# Altium schematic sheet FPGA_board_and_power.SchDoc
size A4
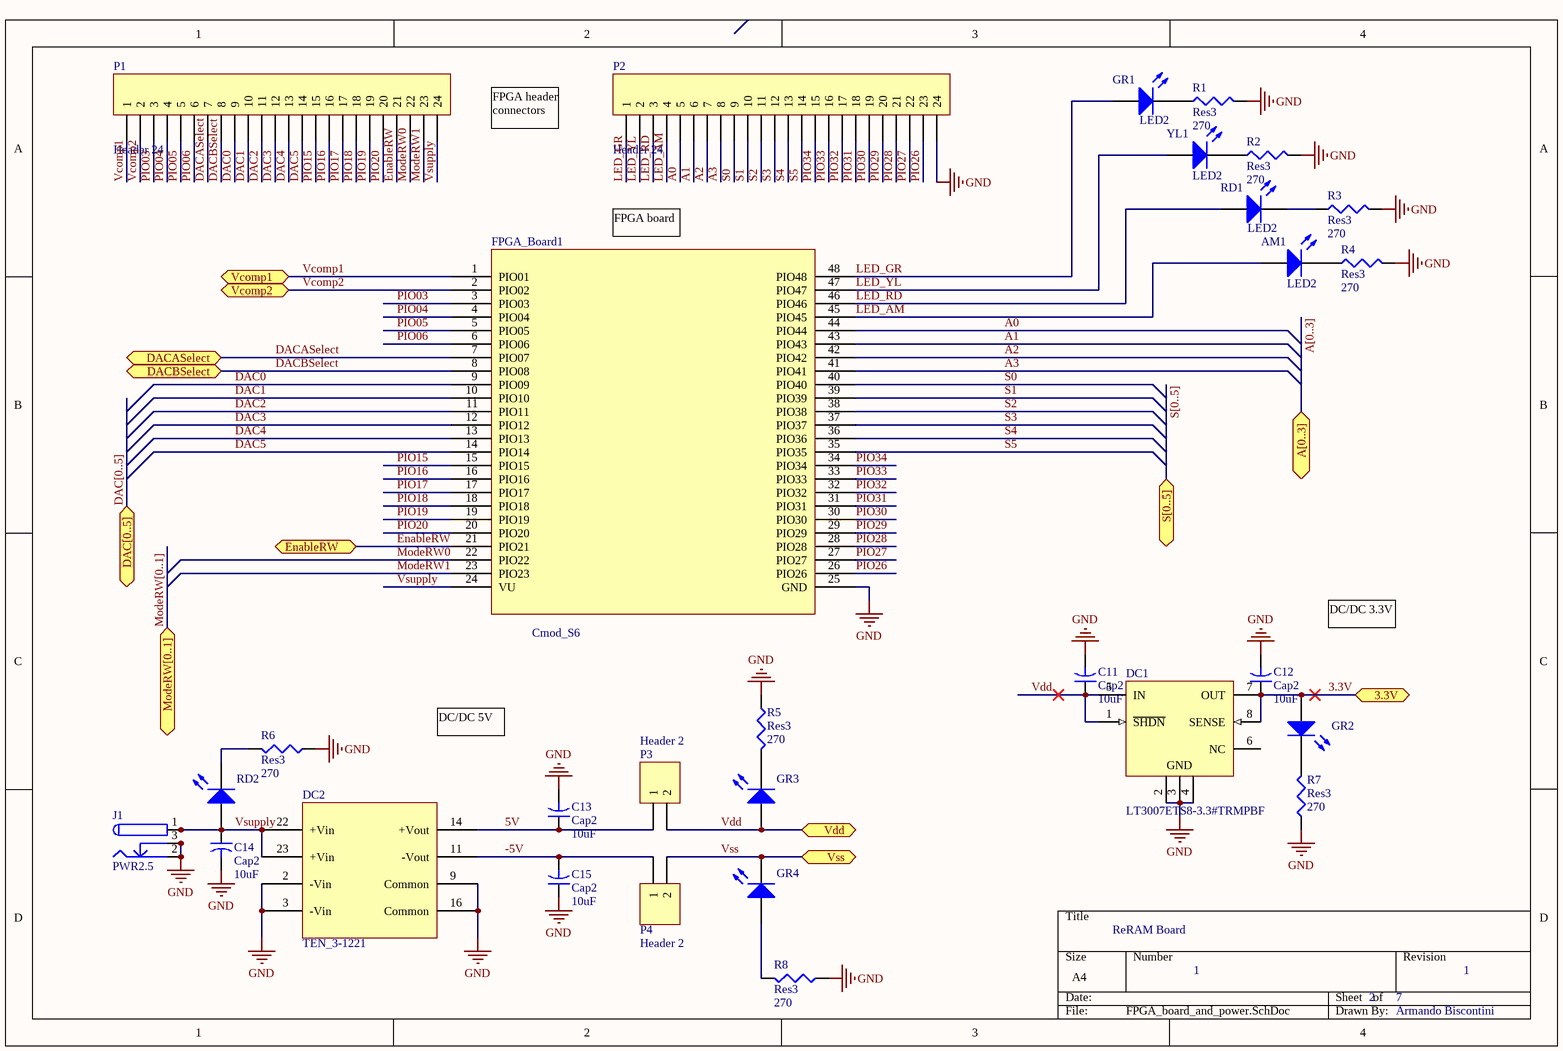
[diagram p0: FPGA_board_and_power.SchDoc]

## Parts
AM1  LED2  [3.2X1.6X1.1]
C11  Cap2  value 10uF  [CAPR5-4X5]
C12  Cap2  value 10uF  [CAPR5-4X5]
C13  Cap2  value 10uF  [CAPR5-4X5]
C14  Cap2  value 10uF  [CAPR5-4X5]
C15  Cap2  value 10uF  [CAPR5-4X5]
DC1  LT3007ETS8-3.3#TRMPBF  [LT-TS8-8-TSOT-23_V]
DC2  TEN_3-1221  [TEN_3-1221]
FPGA_Board1  Cmod_S6  [Cmod_S6_double_conn]
GR1  LED2  [3.2X1.6X1.1]
GR2  (no value)  [3.2X1.6X1.1]
GR3  (no value)  [3.2X1.6X1.1]
GR4  (no value)  [3.2X1.6X1.1]
J1  PWR2.5  [KLD-0202]
P1  Header 24  [HDR1X24]
P2  Header 24  [HDR1X24]
P3  Header 2  [HDR1X2]
P4  Header 2  [HDR1X2]
R1  Res3  value 270  [J1-0603]
R2  Res3  value 270  [J1-0603]
R3  Res3  value 270  [J1-0603]
R4  Res3  value 270  [J1-0603]
R5  Res3  value 270  [J1-0603]
R6  Res3  value 270  [J1-0603]
R7  Res3  value 270  [J1-0603]
R8  Res3  value 270  [J1-0603]
RD1  LED2  [3.2X1.6X1.1]
RD2  (no value)  [3.2X1.6X1.1]
YL1  LED2  [3.2X1.6X1.1]

## Ports
3.3V, A[0..3], DAC[0..5], DACASelect, DACBSelect, EnableRW, ModeRW[0..1], S[0..5], Vcomp1, Vcomp2, Vdd, Vss

## Nets
GND: C11.2 C12.2 C13.2 C14.2 C15.1 DC1.2(GND) DC1.3(GND) DC1.4(GND) DC2.2(-Vin) DC2.3(-Vin) DC2.9(Common) DC2.16(Common) FPGA_Board1.25(GND) J1.2 J1.2A J1.2B J1.3 J1.3A J1.3B P2.24 R1.1 R2.1 R3.1 R4.1 R5.2 R6.2 R7.2 R8.2
3.3V: C12.1 DC1.7(OUT) DC1.8(SENSE) GR2.1(A) ; port 3.3V
5V: C13.1 DC2.14(+Vout) P3.1
-5V: C15.2 DC2.11(-Vout) P4.1
A0: FPGA_Board1.44(PIO44) P2.5
A1: FPGA_Board1.43(PIO43) P2.6
A2: FPGA_Board1.42(PIO42) P2.7
A3: FPGA_Board1.41(PIO41) P2.8
DAC0: FPGA_Board1.9(PIO09) P1.9
DAC1: FPGA_Board1.10(PIO10) P1.10
DAC2: FPGA_Board1.11(PIO11) P1.11
DAC3: FPGA_Board1.12(PIO12) P1.12
DAC4: FPGA_Board1.13(PIO13) P1.13
DAC5: FPGA_Board1.14(PIO14) P1.14
DACASelect: FPGA_Board1.7(PIO07) P1.7 ; port DACASelect
DACBSelect: FPGA_Board1.8(PIO08) P1.8 ; port DACBSelect
EnableRW: FPGA_Board1.21(PIO21) P1.21 ; port EnableRW
LED_AM: AM1.1(A) FPGA_Board1.45(PIO45) P2.4
LED_GR: FPGA_Board1.48(PIO48) GR1.1(A) P2.1
LED_RD: FPGA_Board1.46(PIO46) P2.3 RD1.1(A)
LED_YL: FPGA_Board1.47(PIO47) P2.2 YL1.1(A)
ModeRW0: FPGA_Board1.22(PIO22) P1.22
ModeRW1: FPGA_Board1.23(PIO23) P1.23
PIO03: FPGA_Board1.3(PIO03) P1.3
PIO04: FPGA_Board1.4(PIO04) P1.4
PIO05: FPGA_Board1.5(PIO05) P1.5
PIO06: FPGA_Board1.6(PIO06) P1.6
PIO15: FPGA_Board1.15(PIO15) P1.15
PIO16: FPGA_Board1.16(PIO16) P1.16
PIO17: FPGA_Board1.17(PIO17) P1.17
PIO18: FPGA_Board1.18(PIO18) P1.18
PIO19: FPGA_Board1.19(PIO19) P1.19
PIO20: FPGA_Board1.20(PIO20) P1.20
PIO26: FPGA_Board1.26(PIO26) P2.23
PIO27: FPGA_Board1.27(PIO27) P2.22
PIO28: FPGA_Board1.28(PIO28) P2.21
PIO29: FPGA_Board1.29(PIO29) P2.20
PIO30: FPGA_Board1.30(PIO30) P2.19
PIO31: FPGA_Board1.31(PIO31) P2.18
PIO32: FPGA_Board1.32(PIO32) P2.17
PIO33: FPGA_Board1.33(PIO33) P2.16
PIO34: FPGA_Board1.34(PIO34) P2.15
S0: FPGA_Board1.40(PIO40) P2.9
S1: FPGA_Board1.39(PIO39) P2.10
S2: FPGA_Board1.38(PIO38) P2.11
S3: FPGA_Board1.37(PIO37) P2.12
S4: FPGA_Board1.36(PIO36) P2.13
S5: FPGA_Board1.35(PIO35) P2.14
Vcomp1: FPGA_Board1.1(PIO01) P1.1 ; port Vcomp1
Vcomp2: FPGA_Board1.2(PIO02) P1.2 ; port Vcomp2
Vdd: C11.1 DC1.1(~{SHDN}) DC1.5(IN) GR3.1(A) P3.2 ; port Vdd
Vss: GR4.2(K) P4.2 ; port Vss
Vsupply: C14.1 DC2.22(+Vin) DC2.23(+Vin) FPGA_Board1.24(VU) J1.1 J1.1A J1.1B P1.24 RD2.1(A)
NetAM1_2: AM1.2(K) R4.2
NetGR1_2: GR1.2(K) R1.2
NetGR2_2: GR2.2(K) R7.1
NetGR3_2: GR3.2(K) R5.1
NetGR4_1: GR4.1(A) R8.1
NetR2_2: R2.2 YL1.2(K)
NetR3_2: R3.2 RD1.2(K)
NetR6_1: R6.1 RD2.2(K)

Not connected (* = marked no-connect by the designer): DC1 6(NC)

## Buses and harness runs
bus A[0..3] = port A[0..3]
bus DAC[0..5] = port DAC[0..5]
bus ModeRW[0..1] = port ModeRW[0..1]
bus S[0..5] = port S[0..5]

## Notes on the sheet
- FPGA header connectors
- (near FPGA_Board1) FPGA board
- DC/DC 3.3V
- DC/DC 5V
- ReRAM Board
- 1
- 2
- 7
- Armando Biscontini

## Library data of the parts
AM1 GR1-GR4 RD1 RD2 YL1 = LED2: Typical RED, GREEN, YELLOW, AMBER GaAs LED; Published: 8-Jun-2000; LatestRevisionDate: 17-Jul-2002; LatestRevisionNote: Re-released for DXP Platform.; PackageVersion: Feb-2002; PackageReference: 3.2X1.6X1.1; Publisher: Altium Limited; PackageDescription: SM LED; 2 Flat Leads
C11-C15 = Cap2: Capacitor; Published: 23-Sep-2002; PackageReference: CAPR5-4X5; Publisher: Altium Limited; PackageDescription: Capacitor; 2 Leads
DC1 = LT3007ETS8-3.3#TRMPBF: 3 uA IQ, 20 mA, Low Dropout Fault Tolerant Linear Regulator, 2 to 45 V Vin, 3.3 V Vout, 8-pin SOT23 (TS8-8), -40 to 125 degC, Pb-Free, Mini Tape and Reel; Manufacturer: Linear Technology; Discrete Pass Element: no; Dropout Voltage(V): 0.3; Iout(mA): 20; Isupply(mA): 0.003; Noise(uV): 92; Number of Outputs: 1; Output Voltage: 3.3 V; PSRR(dB): 59; Vin Max(V): 45; Vin Min(V): 2; PackageVersion: Rev. A, 08/2010; PackageReference: TS8-8; PackageDescription: 8-Pin Plastic TSOT-23, Body 2.9 x 1.63 mm, Pitch 0.65 mm; Supplier 1: Digi-Key; Supplier Part Number 1: LT3007ETS8-3.3#TRMPBF-ND; Supplier 2: Newark; Supplier Part Number 2: 71W8541; Packing: Mini Tape and Reel; RoHS: TRUE; Shutdown Current(uA): 1; Mounting Technology: Surface Mount; Code_JEDEC: MO-193; PartNumber: LT3007ETS8-3.3#TRMPBF; ComponentLink1Description: Manufacturer URL; ComponentLink1URL: http://www.linear.com/; ComponentLink2Description: Datasheet; ComponentLink2URL: http://cds.linear.com/docs/en/datasheet/3007f.pdf; ComponentLink3Description: Package Specification; ComponentLink3URL: http://cds.linear.com/docs/en/packaging/SOT_8_05-08-1637.pdf
DC2 = TEN_3-1221: Tracopower TEN 3-1221
FPGA_Board1 = Cmod_S6: Digilent Cmod S6 Board
J1 = PWR2.5: Low Voltage Power Supply Connector; Published: 17-Dec-2003; DatasheetDocument: 09-May-2002; Publisher: Altium Limited; ComponentLink1Description: Manufacturer Link; ComponentLink1URL: http://domino.kycon.com/internet/Products.html
P1 P2 = Header 24: Header, 24-Pin; LatestRevisionDate: 17-Jul-2002; LatestRevisionNote: Re-released for DXP Platform.; Publisher: Altium Limited
P3 P4 = Header 2: Header, 2-Pin; LatestRevisionDate: 17-Jul-2002; LatestRevisionNote: Re-released for DXP Platform.; Publisher: Altium Limited
R1-R8 = Res3: Resistor; Published: 8-Jun-2000; LatestRevisionDate: 29-May-2009; LatestRevisionNote: IPC-7351 Footprint Added.; PackageReference: J1-0603; Publisher: Altium Limited; PackageDescription: Chip Resistor